# EAGLE design NaviMecBoard (EAGLE 6.5.0)
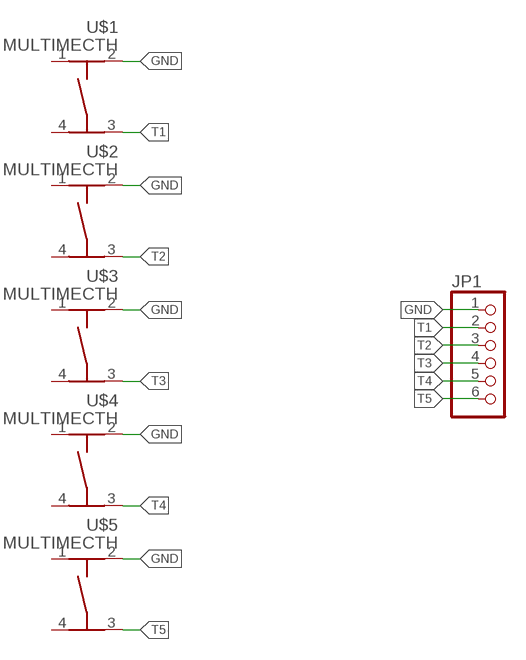
[diagram p0: schematic, sheet 1]

## Parts
JP1  PINHD-1X6  [1X06]
U$1  MULTIMECTH  [MULTIMEC_TH]
U$2  MULTIMECTH  [MULTIMEC_TH]
U$3  MULTIMECTH  [MULTIMEC_TH]
U$4  MULTIMECTH  [MULTIMEC_TH]
U$5  MULTIMECTH  [MULTIMEC_TH]

## Nets
GND: JP1.1 U$1.2 U$2.2 U$3.2 U$4.2 U$5.2
T1: JP1.2 U$1.3
T2: JP1.3 U$2.3
T3: JP1.4 U$3.3
T4: JP1.5 U$4.3
T5: JP1.6 U$5.3
Unconnected: U$1.1 U$1.4 U$2.1 U$2.4 U$3.1 U$3.4 U$4.1 U$4.4 U$5.1 U$5.4

## Library data of the parts
JP1 = pinhead:PINHD-1X6: PIN HEADER
U$1-U$5 = taster:MULTIMEC: multimec switch smd type

## Board
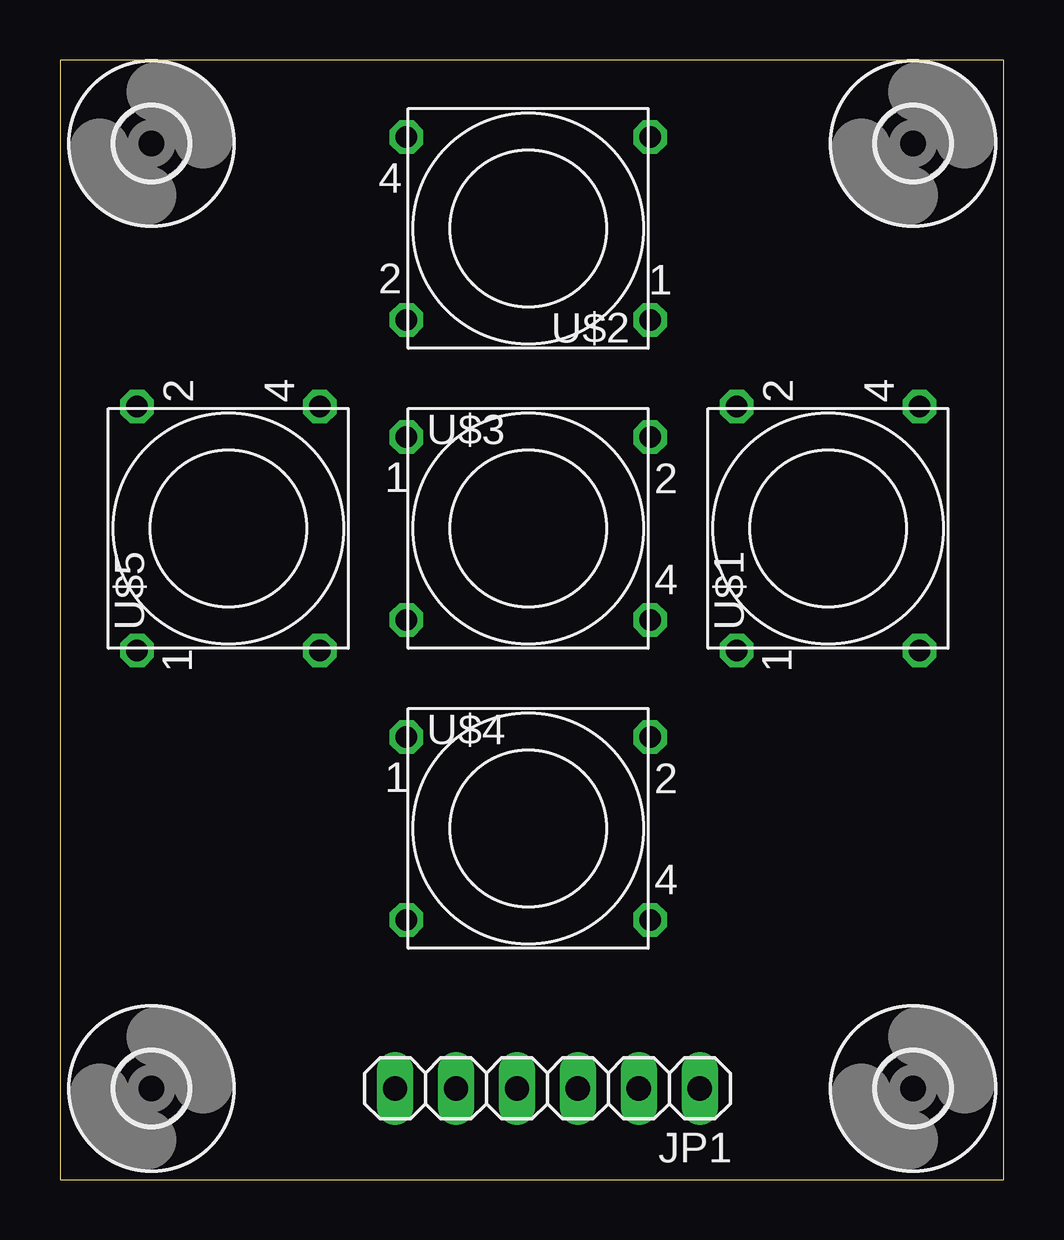
[diagram p1: board, top side]
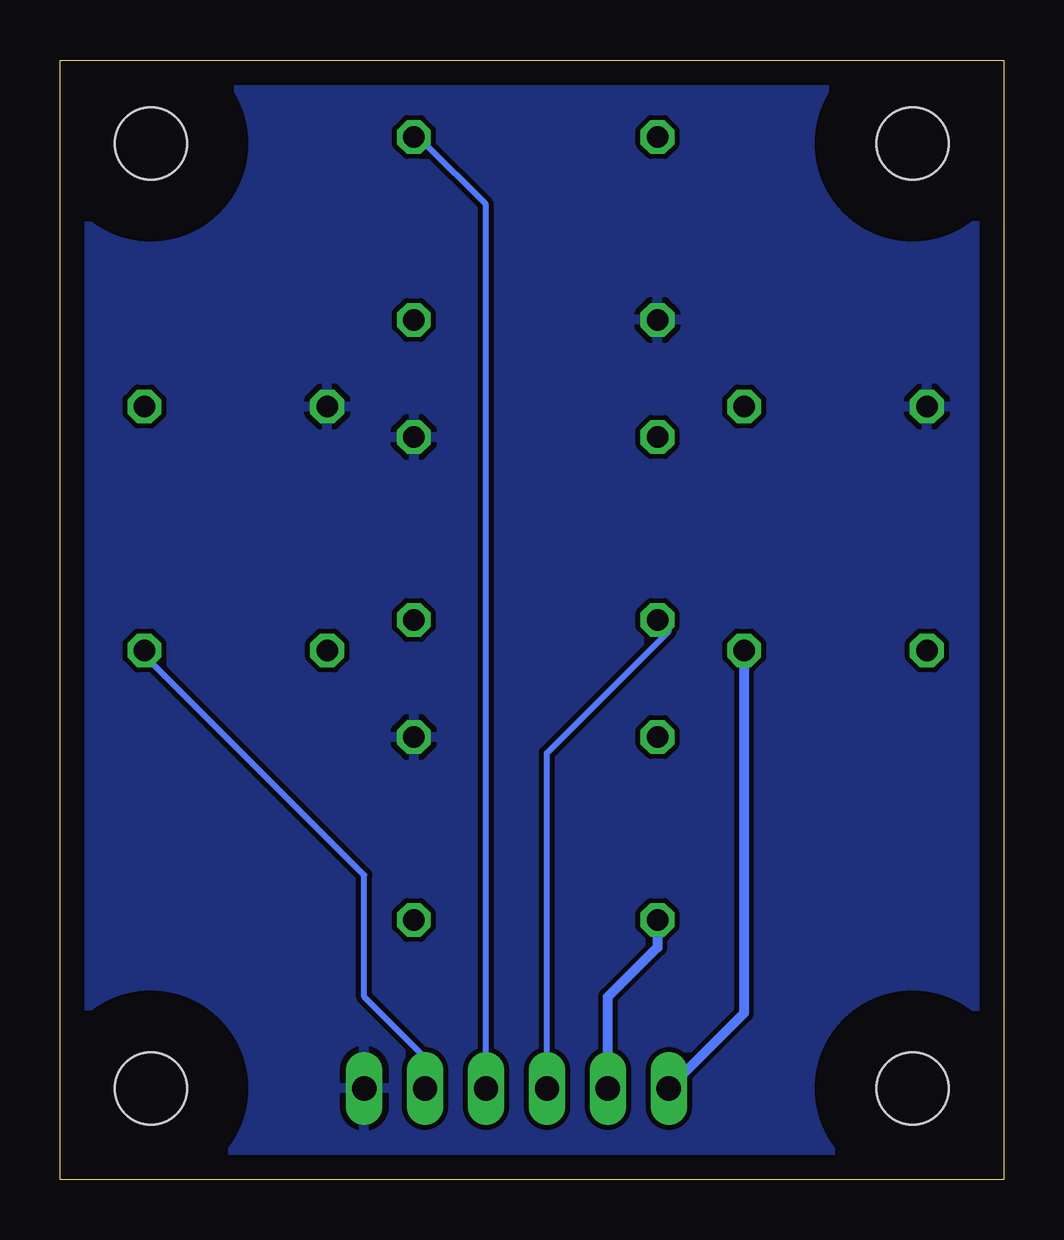
[diagram p2: board, bottom side, seen from below]

Size 39.35 x 46.66 mm. Coordinates in mm from the lower left corner, seen from the top.
Outline: 0,0 39.35,0 39.35,46.66 0,46.66 0,0
Copper layers (1*16): Top 0.035mm / dielectric 1.5mm / Bottom 0.035mm
Design rules "default": minimum track width 10mil, minimum drill 24mil, track to track 8mil, track to pad 8mil, pad to pad 8mil, via to via 8mil, smd to smd 8mil, copper to edge 40mil, drill to drill 8mil, minimum pad ring 10mil, minimum via ring 8mil, stop-mask expansion 4mil, vias tented up to drill 0mil, thermal gap 10mil

### Footprints (pad centres in the part's own frame; a part is rotated, then mirrored left to right if it is on the bottom)
1X06 = drill 1.016 long: 1 -6.35,0; 2 -3.81,0; 3 -1.27,0; 4 1.27,0; 5 3.81,0; 6 6.35,0
MULTIMEC_TH = drill 0.9 octagon: 1 -5.08,3.81; 2 5.08,3.81; 3 -5.08,-3.81; 4 5.08,-3.81
3,0 = hole 3: 0,0

### Placement (x,y rotation side)
JP1  20.32,3.81 180 top
U$1  32.02,27.14 90 top
U$2  19.52,39.64 180 top
U$3  19.52,27.14 0 top
U$4  19.52,14.64 0 top
U$5  7.02,27.14 90 top
U$6  [3,0]  3.81,43.18 0 top
U$7  [3,0]  35.56,43.18 0 top
U$8  [3,0]  35.56,3.81 0 top
U$9  [3,0]  3.81,3.81 0 top

### Tracks (layer width: path | path; a pad name or v marks a point on that pad's centre or on a via)
GND
  pour Bottom: -21.59,53.34 46.99,53.34 46.99,-6.35 -21.59,-6.35
T1
  Bottom 0.254: JP1.2 24.13,5.08 26.67,7.62 26.67,12.7 35.56,21.59 U$1.3
T2
  Bottom 0.254: JP1.3 21.59,40.64 24.13,43.18 U$2.3
T3
  Bottom 0.254: JP1.4 19.05,17.78 13.97,22.86 U$3.3
T4
  Bottom 0.406: JP1.5 16.51,7.62 14.44,9.69 U$4.3
T5
  Bottom 0.406: U$5.3 10.83,6.95 JP1.6